# EAGLE design SNES1Chip_SCIC_IGR_D4_Takt_SMD (EAGLE 7.0.0)
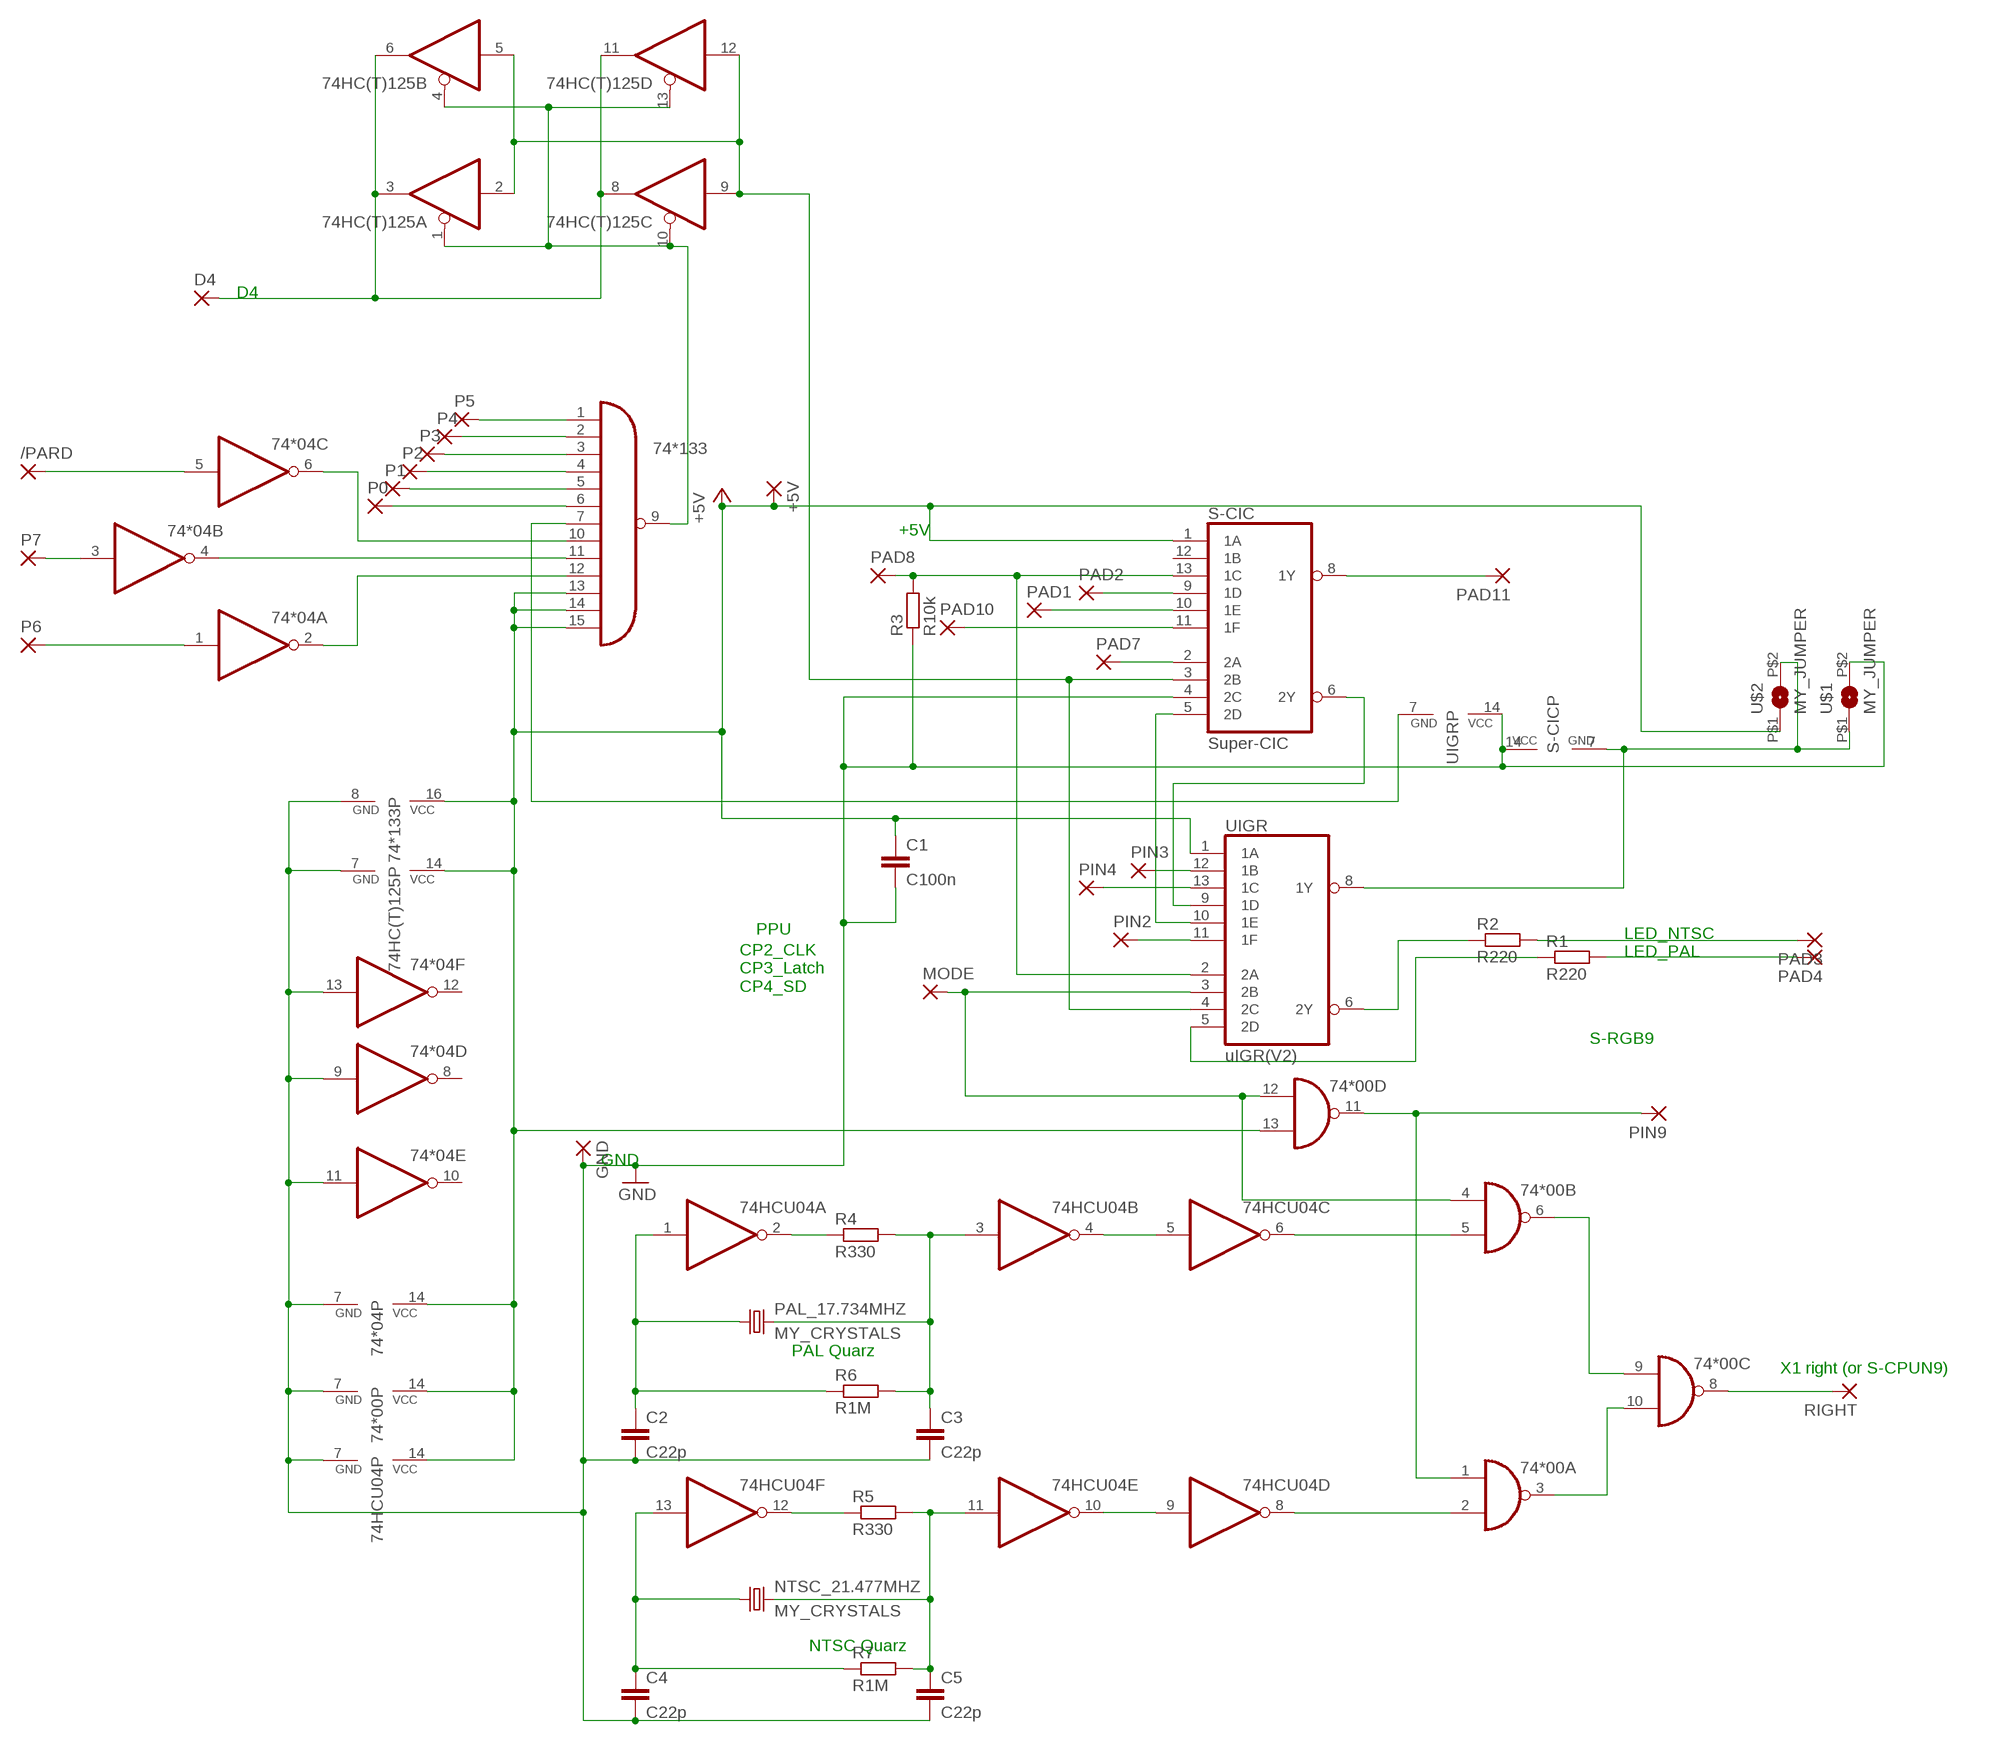
[diagram p0: schematic, sheet 1]

## Parts
74*00  7400D  [SO14]
74*04  74S04D  [SO14]
74*133  74S133D  [SO16]
74HC(T)125  74HCT125D  [SO14]
74HCU04  74HC04D  [SO14]
+5V  SMD2  [SMD1,27-2,54]
/PARD  SMD2  [SMD1,27-2,54]
C1  C100n  C-EUC0805  [C0805]
C2  C22p  C-EUC0805  [C0805]
C3  C22p  C-EUC0805  [C0805]
C4  C22p  C-EUC0805  [C0805]
C5  C22p  C-EUC0805  [C0805]
D4  SMD2  [SMD1,27-2,54]
GND  SMD2  [SMD1,27-2,54]
MODE  SMD2  [SMD1,27-2,54]
NTSC_21.477MHZ  MY_CRYSTALS  [MY_SMD_CRYSTAL2]
P0  SMD2  [SMD1,27-2,54]
P1  SMD2  [SMD1,27-2,54]
P2  SMD2  [SMD1,27-2,54]
P3  SMD2  [SMD1,27-2,54]
P4  SMD2  [SMD1,27-2,54]
P5  SMD2  [SMD1,27-2,54]
P6  SMD2  [SMD1,27-2,54]
P7  SMD2  [SMD1,27-2,54]
PAD1  SMD2  [SMD1,27-2,54]
PAD2  SMD2  [SMD1,27-2,54]
PAD3  SMD2  [SMD1,27-2,54]
PAD4  SMD2  [SMD1,27-2,54]
PAD7  SMD2  [SMD1,27-2,54]
PAD8  SMD2  [SMD1,27-2,54]
PAD10  SMD2  [SMD1,27-2,54]
PAD11  SMD2  [SMD1,27-2,54]
PAL_17.734MHZ  MY_CRYSTALS  [MY_SMD_CRYSTAL2]
PIN2  SMD2  [SMD1,27-2,54]
PIN3  SMD2  [SMD1,27-2,54]
PIN4  SMD2  [SMD1,27-2,54]
PIN9  SMD2  [SMD1,27-2,54]
R1  R220  R-EU_R0805  [R0805]
R2  R220  R-EU_R0805  [R0805]
R3  R10k  R-EU_R0805  [R0805]
R4  R330  R-EU_R0805  [R0805]
R5  R330  R-EU_R0805  [R0805]
R6  R1M  R-EU_R0805  [R0805]
R7  R1M  R-EU_R0805  [R0805]
RIGHT  SMD2  [SMD1,27-2,54]
S-CIC  Super-CIC  74HC51D  [SO14]
U$1  MY_JUMPER  [MYJUMP]
U$2  MY_JUMPER  [MYJUMP]
UIGR  uIGR(V2)  74HC51D  [SO14]

## Nets
+5V: 74*00.13(D:I1) 74*00.14(P:VCC) 74*04.14(P:VCC) 74*133.13(I10) 74*133.14(I11) 74*133.15(I12) 74*133.16(VCC) 74HC(T)125.14(P:VCC) 74HCU04.14(P:VCC) +5V.1(P) C1.1 S-CIC.1(1A) U$2.P$1 UIGR.1(1A)
GND: 74*00.7(P:GND) 74*04.7(P:GND) 74*04.9(D:I) 74*04.11(E:I) 74*04.13(F:I) 74*133.8(GND) 74HC(T)125.7(P:GND) 74HCU04.7(P:GND) C1.2 C2.2 C3.2 C4.2 C5.2 GND.1(P) R3.1 S-CIC.4(2C) S-CIC.14(VCC) U$1.P$2 UIGR.14(VCC)
N$1: 74*04.4(B:O) 74*133.11(I8)
N$2: 74*133.9(O) 74HC(T)125.1(A:OE) 74HC(T)125.4(B:OE) 74HC(T)125.10(C:OE) 74HC(T)125.13(D:OE)
N$3: PAD10.1(P) S-CIC.11(1F)
N$4: PAD11.1(P) S-CIC.8(1Y)
N$5: PAD3.1(P) R2.2
N$6: 74*04.1(A:I) P6.1(P)
N$7: R2.1 UIGR.6(2Y)
N$8: S-CIC.7(GND) U$1.P$1 U$2.P$2 UIGR.8(1Y)
N$9: 74*04.6(C:O) 74*133.10(I7)
N$10: PAD7.1(P) S-CIC.2(2A)
N$11: R1.1 UIGR.5(2D)
N$12: PAD2.1(P) S-CIC.9(1D)
N$13: PAD1.1(P) S-CIC.10(1E)
N$14: PAD4.1(P) R1.2
N$15: 74*133.6(I5) P0.1(P)
N$16: 74*04.3(B:I) P7.1(P)
N$17: PIN2.1(P) UIGR.11(1F)
N$18: PIN3.1(P) UIGR.12(1B)
N$19: PIN4.1(P) UIGR.13(1C)
N$20: 74*04.2(A:O) 74*133.12(I9)
N$21: 74*133.1(I0) P5.1(P)
N$22: 74*133.2(I1) P4.1(P)
N$23: S-CIC.6(2Y) UIGR.9(1D)
N$24: 74*133.3(I2) P3.1(P)
N$25: 74*133.4(I3) P2.1(P)
N$26: 74*04.5(C:I) /PARD.1(P)
N$27: 74HCU04.1(A:I) C2.1 PAL_17.734MHZ.1 R6.1
N$28: 74HCU04.3(B:I) C3.1 PAL_17.734MHZ.2 R4.2 R6.2
N$29: 74HCU04.13(F:I) C4.1 NTSC_21.477MHZ.1 R7.1
N$30: 74HCU04.11(E:I) C5.1 NTSC_21.477MHZ.2 R5.2 R7.2
N$31: 74*00.3(A:O) 74*00.10(C:I1)
N$32: 74*00.6(B:O) 74*00.9(C:I0)
N$33: 74*00.4(B:I0) 74*00.12(D:I0) MODE.1(P) UIGR.3(2B)
N$34: PAD8.1(P) R3.2 S-CIC.13(1C) UIGR.2(2A)
N$35: 74*00.1(A:I0) 74*00.11(D:O) PIN9.1(P)
N$36: 74*00.8(C:O) RIGHT.1(P)
N$37: 74HCU04.2(A:O) R4.1
N$38: 74HCU04.4(B:O) 74HCU04.5(C:I)
N$39: 74*00.5(B:I1) 74HCU04.6(C:O)
N$40: 74*133.5(I4) P1.1(P)
N$41: 74*00.2(A:I1) 74HCU04.8(D:O)
N$42: 74HC(T)125.3(A:O) 74HC(T)125.6(B:O) 74HC(T)125.8(C:O) 74HC(T)125.11(D:O) D4.1(P)
N$43: 74*133.7(I6) UIGR.7(GND)
N$44: 74HCU04.9(D:I) 74HCU04.10(E:O)
N$50: 74HCU04.12(F:O) R5.1
N$53: S-CIC.5(2D) UIGR.10(1E)
UIGR: 74HC(T)125.2(A:I) 74HC(T)125.5(B:I) 74HC(T)125.9(C:I) 74HC(T)125.12(D:I) S-CIC.3(2B) UIGR.4(2C)
Unconnected: 74*04.8(D:O) 74*04.10(E:O) 74*04.12(F:O) S-CIC.12(1B)

## Notes on the sheet
- D4
- +5V
- PPU
- LED_NTSC
  LED_PAL
- CP2_CLK
  CP3_Latch
  CP4_SD
- S-RGB9
- GND
- PAL Quarz
- X1 right (or S-CPUN9)
- NTSC Quarz

## Library data of the parts
74*00 = 74xx-eu:74*00: Quad 2-input NAND gate
74*04 74HCU04 = 74xx-eu:74*04: Hex INVERTER
74*133 = 74xx-eu:74*133: 13-input NAND gate
74HC(T)125 = 74xx-eu:74*125: Quad bus BUFFER, 3-state
+5V /PARD D4 GND MODE P0 P1-P7 PAD1-PAD4 PAD7 PAD8 PAD10 PAD11 PIN2-PIN4 PIN9 RIGHT = wirepad:SMD2: SMD PAD
C1-C5 = rcl:C-EU: CAPACITOR, European symbol
NTSC_21.477MHZ PAL_17.734MHZ = snes_div:MY_CRYSTALS
R1-R7 = rcl:R-EU_: RESISTOR, European symbol
S-CIC UIGR = 74xx-eu:74*51: AND-OR-INVERT gates/for S-type see 74S51 <DEVICE:74S51>
U$1 U$2 = snes_div:MY_JUMPER

## Board
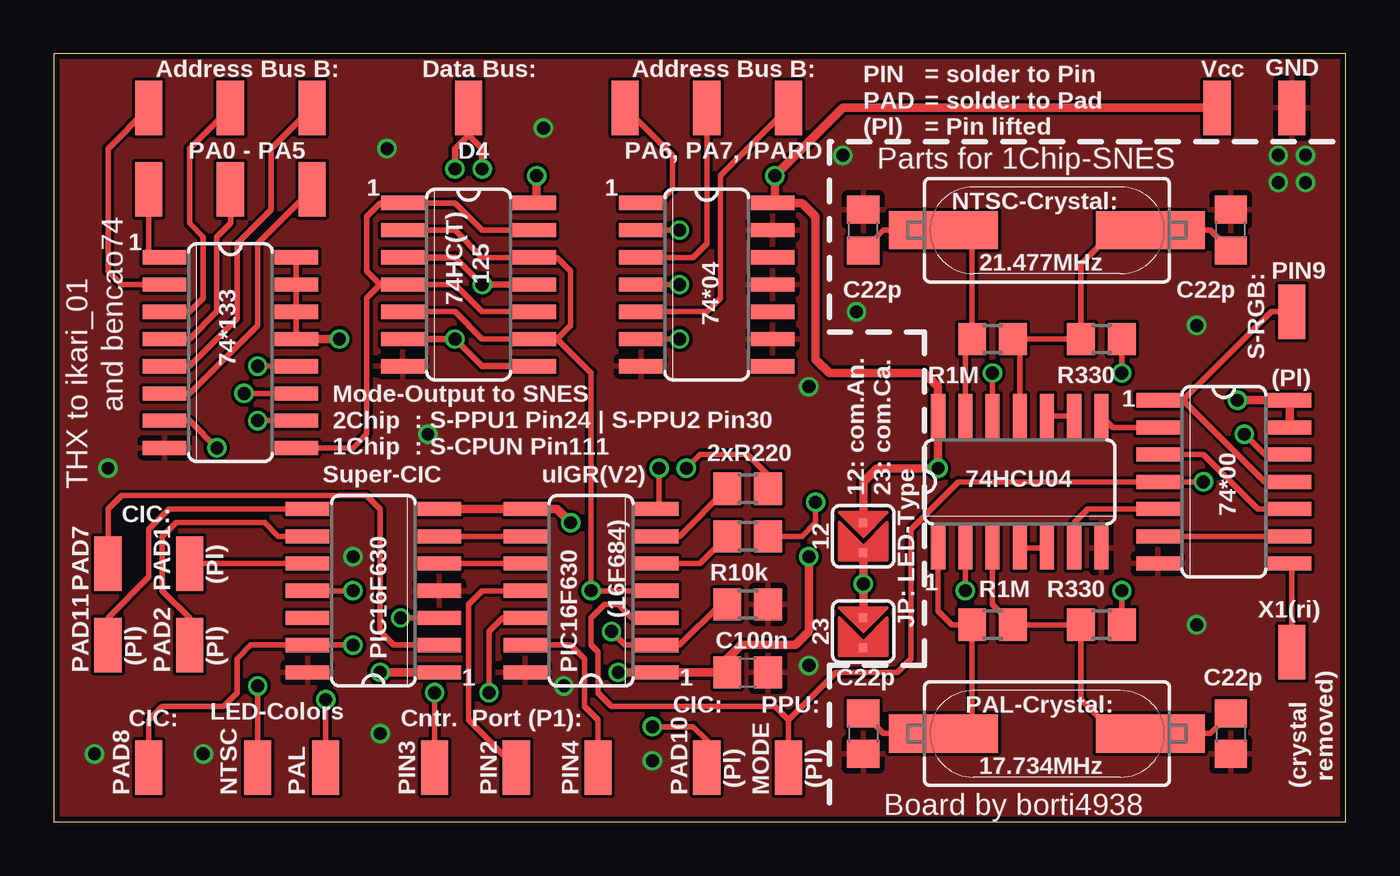
[diagram p1: board, top side]
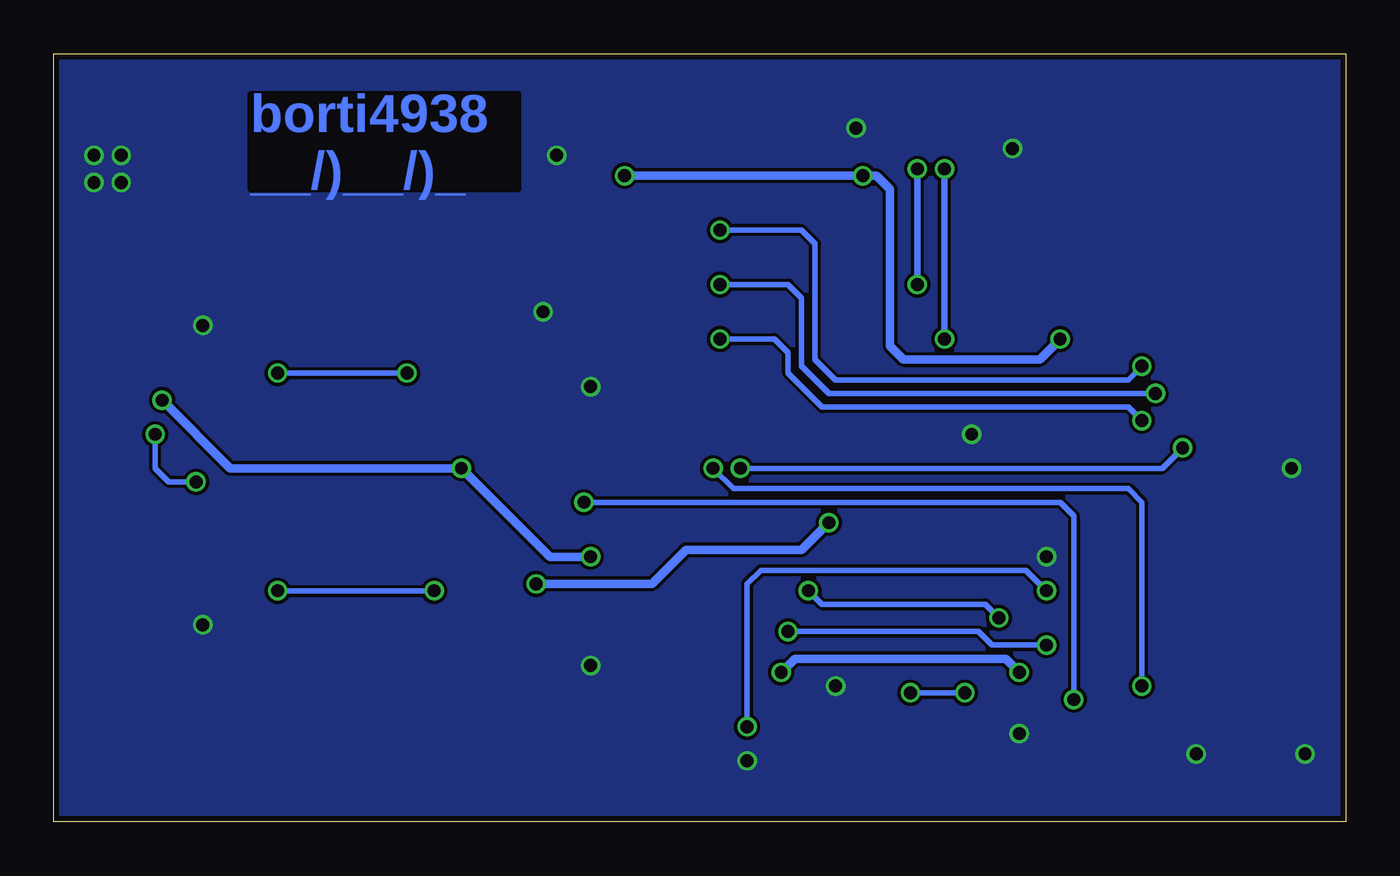
[diagram p2: board, bottom side, seen from below]

Size 60.3 x 35.87 mm. Coordinates in mm from the lower left corner, seen from the top.
Outline: 0,0 60.3,0 60.3,35.87 0,35.87 0,0
Copper layers (1*16): Top 0.035mm / dielectric 1.5mm / Bottom 0.035mm
Design rules "ITEADstudio_DRC": minimum track width 6mil, minimum drill 12mil, track to track 6mil, track to pad 6mil, pad to pad 6mil, via to via 6mil, smd to smd 0mil, copper to edge 10mil, drill to drill 10mil, minimum pad ring 10mil, minimum via ring 6mil, stop-mask expansion 2mil, vias tented up to drill 100mil, thermal gap 10mil

### Footprints (pad centres in the part's own frame; a part is rotated, then mirrored left to right if it is on the bottom)
SO14 = smd 0.66 x 2.032: 1 -3.81,-3.073; 2 -2.54,-3.073; 3 -1.27,-3.073; 4 0,-3.073; 5 1.27,-3.073; 6 2.54,-3.073; 7 3.81,-3.073; 8 3.81,3.073; 9 2.54,3.073; 10 1.27,3.073; 11 0,3.073; 12 -1.27,3.073; 13 -2.54,3.073; 14 -3.81,3.073
SO16 = smd 0.66 x 2.032: 1 -4.445,-3.073; 2 -3.175,-3.073; 3 -1.905,-3.073; 4 -0.635,-3.073; 5 0.635,-3.073; 6 1.905,-3.073; 7 3.175,-3.073; 8 4.445,-3.073; 9 4.445,3.073; 10 3.175,3.073; 11 1.905,3.073; 12 0.635,3.073; 13 -0.635,3.073; 14 -1.905,3.073; 15 -3.175,3.073; 16 -4.445,3.073
SMD1,27-2,54 = smd 1.27 x 2.54: 1 0,0
C0805 = smd 1.3 x 1.5: 1 -0.95,0; 2 0.95,0
MY_SMD_CRYSTAL2 = smd 5.08 x 1.778: 1 -4.826,0; 2 4.826,0
R0805 = smd 1.3 x 1.5: 1 -0.95,0; 2 0.95,0
MYJUMP = smd 0.406 x 0.406: P$1 -0.635,0; P$2 0.765,0

### Placement (x,y rotation side)
74*00  54.61,15.88 270 top
74*04  30.48,25.08 270 top
74*133  8.26,21.91 270 top
74HC(T)125  19.37,25.08 270 top
74HCU04  45.09,15.88 0 top
+5V  54.29,33.34 0 top
/PARD  34.29,33.34 0 top
C1  32.38,6.99 0 top
C2  37.78,4.13 270 top
C3  54.93,4.13 270 top
C4  37.78,27.62 90 top
C5  54.93,27.62 90 top
D4  19.37,33.34 0 top
GND  57.78,33.34 0 top
MODE  34.29,2.54 0 top
NTSC_21.477MHZ  46.35,27.62 0 top
P0  12.06,29.53 0 top
P1  12.06,33.34 0 top
P2  8.26,29.53 0 top
P3  8.26,33.34 0 top
P4  4.45,33.34 0 top
P5  4.45,29.53 0 top
P6  26.67,33.34 0 top
P7  30.48,33.34 0 top
PAD1  6.35,12.06 0 top
PAD2  6.35,8.26 0 top
PAD3  9.53,2.54 0 top
PAD4  12.7,2.54 0 top
PAD7  2.54,12.06 0 top
PAD8  4.45,2.54 0 top
PAD10  30.48,2.54 0 top
PAD11  2.54,8.26 0 top
PAL_17.734MHZ  46.35,4.13 0 top
PIN2  21.59,2.54 0 top
PIN3  17.78,2.54 0 top
PIN4  25.4,2.54 0 top
PIN9  57.78,23.81 0 top
R1  32.38,13.34 0 top
R2  32.38,15.56 0 top
R3  32.38,10.16 180 top
R4  48.9,9.21 180 top
R5  48.9,22.54 180 top
R6  43.81,9.21 0 top
R7  43.81,22.54 0 top
RIGHT  57.78,7.94 0 top
S-CIC  14.92,10.79 90 top
U$1  37.78,8.89 270 top
U$2  37.78,13.34 270 top
UIGR  25.08,10.79 90 top

### Tracks (layer width: path | path; a pad name or v marks a point on that pad's centre or on a via)
+5V  (via drill 0.6)
  Top 0.254: 33.02,28.89 74*04.14 33.66,28.99 | 21.91,28.89 74HC(T)125.14 22.54,28.89 | 74HCU04.14 41.17,18.41 41.27,18.31 | 74*133.16 74*133.15 74*133.14 74*133.13
  Top 0.406: 22.54,28.89 v22.54,30.16 | 74*00.13 74*00.14 v55.24,19.68 | 74HCU04.14 41.27,20.32 40.64,20.95 36.2,20.95 35.56,21.59 35.56,28.26 34.92,28.89 74*04.14 | 41.27,18.31 v41.27,16.51 38.42,16.51 37.78,15.88 U$2.P$1 | 33.66,28.99 v33.66,30.16 36.83,33.34 +5V.1 | v26.35,6.99 UIGR.1 C1.1 31.43,7.62 32.07,8.26 34.61,8.26 35.24,8.89 v35.24,12.38 | S-CIC.1 v15.24,6.99 | v13.34,22.54 74*133.13
  Bottom 0.406: v55.24,19.68 52.07,16.51 v41.27,16.51 37.15,12.38 v35.24,12.38 | v33.66,30.16 v22.54,30.16 21.91,30.16 21.27,29.53 21.27,22.23 20.64,21.59 14.29,21.59 v13.34,22.54 | v15.24,6.99 15.88,7.62 25.72,7.62 v26.35,6.99
GND  (via drill 0.6)
  other vias: 37.47,23.81 53.34,23.18 13.97,12.38 1.91,3.17 36.83,31.11 27.94,2.86 15.24,4.13 35.24,20.32 23.81,6.35 53.34,9.21 15.56,31.43 2.54,16.51 35.24,7.3 6.99,3.17 17.46,18.1 22.86,32.38 57.15,31.11 58.42,31.11 58.42,29.84 57.15,29.84
  pour Bottom: 0,35.88 60.33,35.88 60.33,0 0,0
  pour Top: 0,35.88 60.33,35.88 60.33,0 0,0
N$1  (via drill 0.6)
  Top 0.254: 74*04.4 v29.21,25.08 | 74*133.11 v8.89,20
  Bottom 0.254: v29.21,25.08 26.04,25.08 25.4,24.45 25.4,21.27 24.13,20 v8.89,20
N$2
  Top 0.254: 74HC(T)125.10 20,23.81 18.73,25.08 74HC(T)125.4 15.24,25.08 | 74HC(T)125.13 20,27.62 18.73,28.89 74HC(T)125.1 15.24,28.89 14.61,28.26 14.61,25.72 15.24,25.08 | 74*133.9 13.97,17.46 14.61,18.1 14.61,24.45 15.24,25.08
N$3  (via drill 0.6)
  Top 0.254: S-CIC.11 v13.97,10.79 | v27.94,4.45 29.84,4.45 30.48,3.81 PAD10.1
  Bottom 0.254: v13.97,10.79 14.92,11.75 27.3,11.75 27.94,11.11 v27.94,4.45
N$4
  Top 0.254: S-CIC.8 5.4,14.61 4.45,13.65 4.45,11.43 2.54,9.53 PAD11.1
N$5  (via drill 0.6)
  Top 0.254: R2.2 33.34,16.2 32.38,17.14 30.16,17.14 v29.53,16.51 | v9.53,6.35 PAD3.1
  Bottom 0.254: v29.53,16.51 28.57,15.56 10.16,15.56 9.53,14.92 v9.53,6.35
N$6
  Top 0.254: 27.3,28.99 74*04.1 | 26.67,28.89 74*04.1 | P6.1 28.89,31.11 28.89,29.53 28.26,28.89 74*04.1
N$7
  Top 0.254: UIGR.6 29.21,13.34 R2.1
N$8  (via drill 0.6)
  Top 0.406: S-CIC.7 UIGR.8 23.5,14.61 v24.13,13.97 | U$2.P$2 v37.78,11.11 U$1.P$1
  Bottom 0.406: v24.13,13.97 25.4,12.7 30.8,12.7 32.38,11.11 v37.78,11.11
N$9  (via drill 0.6)
  Top 0.254: 26.99,22.54 74*04.6 v29.21,22.54 | v9.53,18.73 74*133.10
  Bottom 0.254: v29.21,22.54 26.67,22.54 26.04,21.91 26.04,20.95 24.45,19.37 10.16,19.37 v9.53,18.73
N$10
  Top 0.254: PAD7.1 2.54,14.61 3.17,15.24 14.61,15.24 15.24,14.61 15.24,8.89 15.88,8.26 S-CIC.2
N$11
  Top 0.254: UIGR.5 30.16,12.06 R1.1
N$12
  Top 0.254: S-CIC.9 10.48,13.34 9.84,13.97 5.71,13.97 5.08,13.34 5.08,10.79 6.35,9.53 PAD2.1
N$13
  Top 0.254: S-CIC.10 PAD1.1
N$14  (via drill 0.6)
  Top 0.254: R1.2 34.92,13.34 35.56,13.97 v35.56,14.92 | v12.7,5.71 PAD4.1
  Bottom 0.254: v35.56,14.92 13.34,14.92 12.7,14.29 v12.7,5.71
N$15
  Top 0.254: 74*133.6 6.35,20 9.53,23.18 9.53,26.99 P0.1
N$16
  Top 0.254: 74*04.3 29.84,26.35 30.48,26.99 P7.1
N$17
  Top 0.254: UIGR.11 20,10.79 19.37,10.16 19.37,4.76 PIN2.1
N$18  (via drill 0.6)
  Top 0.254: UIGR.12 20.95,9.53 20.32,8.89 v20.32,6.03 | v17.78,6.03 PIN3.1
  Bottom 0.254: v20.32,6.03 v17.78,6.03
N$19
  Top 0.254: PIN4.1 25.4,4.76 24.77,5.4 24.77,7.62 24.13,8.26 UIGR.13
N$20  (via drill 0.6)
  Top 0.254: 74*04.2 v29.21,27.62 | v9.53,21.27 74*133.12
  Bottom 0.254: v9.53,21.27 10.16,20.64 23.81,20.64 24.77,21.59 24.77,26.99 25.4,27.62 v29.21,27.62
N$21
  Top 0.254: 5.71,26.35 74*133.1 4.45,26.35 P5.1
N$22
  Top 0.254: 74*133.2 3.17,25.08 2.54,25.72 2.54,31.43 P4.1
N$23
  Top 0.254: S-CIC.6 UIGR.9
N$24
  Top 0.254: 74*133.3 6.35,23.81 6.99,24.45 6.99,27.3 6.35,27.94 6.35,31.43 P3.1
N$25
  Top 0.254: 74*133.4 6.35,22.54 7.62,23.81 7.62,27.3 8.26,27.94 P2.1
N$26
  Top 0.254: /PARD.1 31.11,30.16 31.11,24.45 30.48,23.81 74*04.5
N$27
  Top 0.254: 74HCU04.1 41.27,9.84 41.91,9.21 R6.1 42.86,4.13 PAL_17.734MHZ.1 38.73,4.13 C2.1
N$28
  Top 0.254: 74HCU04.3 43.81,10.16 R6.2 R4.2 47.94,5.71 49.53,4.13 PAL_17.734MHZ.2 53.98,4.13 C3.1
N$29
  Top 0.254: 74HCU04.13 42.55,22.22 R7.1 42.86,27.62 NTSC_21.477MHZ.1 38.73,27.62 C4.1
N$30
  Top 0.254: 45.09,18.41 74HCU04.11 45.09,22.22 R7.2 R5.2 47.94,26.04 49.53,27.62 NTSC_21.477MHZ.2 53.98,27.62 C5.1
N$31
  Top 0.254: 74*00.3 53.66,17.14 56.2,14.61 74*00.10
N$32
  Top 0.254: 74*00.6 74*00.9
N$33  (via drill 0.6)
  Top 0.254: v53.66,15.88 74*00.4 42.23,15.88 40.01,13.65 40.01,7.62 39.37,6.99 36.51,6.99 34.29,4.76 | v55.56,18.1 56.52,17.14 74*00.12 | UIGR.3 26.99,9.53 26.35,10.16 25.72,10.16 25.08,9.53 25.08,8.26 25.4,7.94 25.4,6.03 26.04,5.4 33.66,5.4 34.29,4.76 | MODE.1 34.29,4.76
  Bottom 0.254: v53.66,15.88 54.93,15.88 55.56,16.51 v55.56,18.1
N$34  (via drill 0.6)
  Top 0.254: R3.2 31.11,10.16 29.21,8.26 UIGR.2 26.67,8.26 v26.04,8.89 | v13.97,8.26 S-CIC.13 9.21,8.26 8.57,7.62 8.57,6.03 7.94,5.4 5.08,5.4 4.45,4.76 PAD8.1
  Bottom 0.254: v13.97,8.26 16.51,8.26 17.14,8.89 v26.04,8.89
N$35
  Top 0.254: 74*00.11 56.52,15.88 52.7,19.68 | 52.7,19.68 74*00.1 | PIN9.1 56.83,23.81 52.7,19.68
N$36
  Top 0.254: RIGHT.1 57.78,11.96 74*00.8
N$37  (via drill 0.6)
  Top 0.254: v49.85,10.79 R4.1 | v42.55,10.79 74HCU04.2
  Bottom 0.254: v49.85,10.79 v42.55,10.79
N$38
  Top 0.254: 74HCU04.4 74HCU04.5
N$39
  Top 0.254: 74*00.5 48.26,14.61 47.62,13.97 74HCU04.6
N$40
  Top 0.254: 74*133.5 6.35,21.27 8.57,23.5 8.57,26.99 10.16,28.57 10.16,31.43 P1.1
N$41
  Top 0.254: 74*00.2 49.43,18.41 74HCU04.8
N$42  (via drill 0.6)
  Top 0.305: 74HC(T)125.6 v18.73,22.54 20,21.27 74HC(T)125.8 | 74HC(T)125.11 v20,25.08 18.73,26.35 74HC(T)125.3 | v20,30.48 20,31.43 19.37,32.07 | 19.37,32.07 D4.1 | v18.73,30.48 18.73,31.43 19.37,32.07
  Bottom 0.305: v20,25.08 v20,30.48 | v18.73,22.54 v18.73,30.48
N$43  (via drill 0.6)
  Top 0.254: v7.62,17.46 6.35,18.73 74*133.7 | v28.26,16.51 28.26,14.71 UIGR.7
  Bottom 0.254: v28.26,16.51 8.57,16.51 v7.62,17.46
N$44
  Top 0.254: 74HCU04.10 74HCU04.9
N$50  (via drill 0.6)
  Top 0.254: v49.85,20.95 R5.1 | v43.81,20.95 74HCU04.12
  Bottom 0.254: v49.85,20.95 v43.81,20.95
N$53
  Top 0.254: S-CIC.5 UIGR.10
UIGR  (via drill 0.6)
  Top 0.254: 74HC(T)125.2 18.73,27.62 20,26.35 74HC(T)125.12 23.5,26.35 24.13,25.72 24.13,23.18 23.5,22.54 | 74HC(T)125.5 18.73,23.81 20,22.54 74HC(T)125.9 23.5,22.54 | S-CIC.3 v16.19,9.53 | UIGR.4 v25.08,10.79 25.08,20.95 23.5,22.54
  Bottom 0.254: v25.08,10.79 24.45,10.16 16.83,10.16 v16.19,9.53

### Text on the board
Bottom: borti4938 / __/)__/)_
tNames: Address Bus B: | Data Bus: | Address Bus B: | Vcc | PA0 - PA5 | D4 | PA6, PA7, /PARD | PIN / PAD / (Pl) | = solder to Pin / = solder to Pad / = Pin lifted | Parts for 1Chip-SNES | 1 | 1 | NTSC-Crystal: | and bencao74 | 1 | 21.477MHz | 74HC(T) / 125 | S-RGB: | (Pl) | 1 | Mode-Output to SNES / 2Chip / 1Chip | : S-PPU1 Pin24 | S-PPU2 Pin30 / : S-CPUN Pin111 | 2xR220 | JP: LED-Type | THX to ikari_01 | 12: com.An. / 23: com.Ca. | CIC: | 12 | (Pl) | 1 | (16F684) | X1(ri) | PIC16F630 | 23 | (Pl) | (Pl) | PIC16F630 | 1 | 1 | LED-Colors | CIC: | PPU: | PAL-Crystal: | CIC: | Cntr. Port (P1): | (Pl) | (Pl) | 17.734MHz | (crystal / removed) | NTSC | PAL | Board by borti4938